# Altium schematic sheet STM32F103_coreboard_2.SchDoc
size A4; SheetNumber: 2
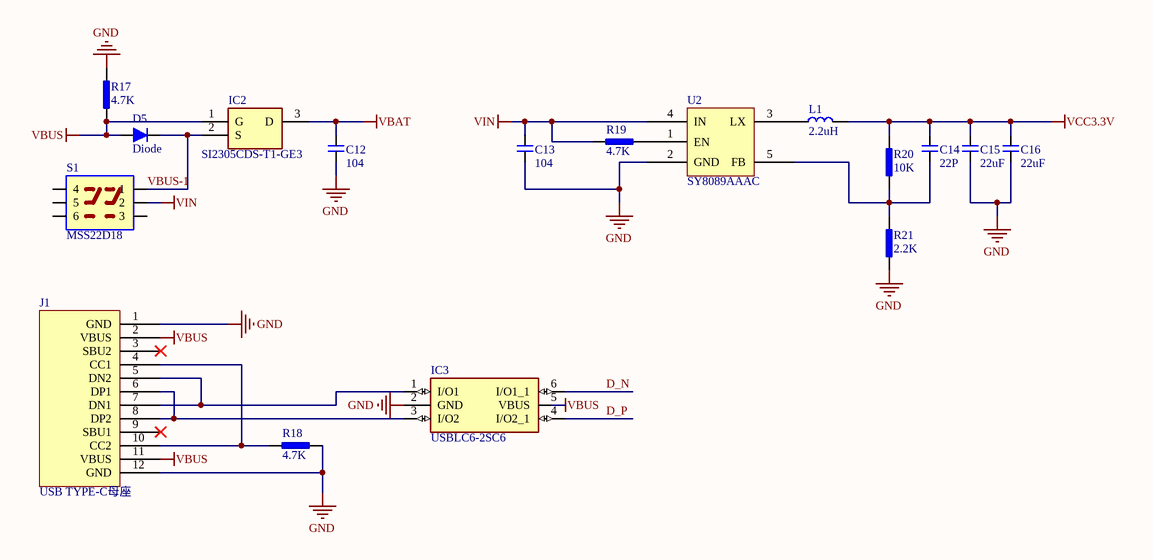
[diagram p0: STM32F103_coreboard_2.SchDoc]

## Parts
C12  104  [C0603]
C13  104  [C0603]
C14  22P  [C0603]
C15  22uF  [C0603]
C16  22uF  [C0603]
D5  Diode  [SOD123]
IC2  SI2305CDS-T1-GE3  [SOT95P237X112-3N]
IC3  USBLC6-2SC6  [SOT95P280X145-6N]
J1  USB TYPE-C母座  [USB-TYPEC-SMT]
L1  2.2uH  [L-CDR5*5]
R17  4.7K  [R0603]
R18  4.7K  [R0603]
R19  4.7K  [R0603]
R20  10K  [R0603]
R21  2.2K  [R0603]
S1  MSS22D18  [SWITCH-MSS22D18]
U2  SY8089AAAC  [SOT-23-5]

## Nets
GND: C12.1 C13.1 C15.1 C16.1 IC3.2(GND) J1.1(GND) J1.12(GND) R17.1 R18.2 R21.1 U2.2(GND)
VBAT: C12.2 IC2.3(D)
VBUS: D5.1 IC2.1(G) IC3.5(VBUS) J1.2(VBUS) J1.11(VBUS) R17.2
VCC3.3V: C14.2 C15.2 C16.2 L1.1 R20.2
VIN: C13.2 R19.1 S1.2 U2.4(IN)
D_N: IC3.6(I/O1_1)
D_P: IC3.4(I/O2_1)
VBUS-1: D5.2 IC2.2(S) S1.1
NetC14_1: C14.1 R20.1 R21.2 U2.5(FB)
NetIC3_1: IC3.1(I/O1) J1.5(DN2) J1.7(DN1)
NetIC3_3: IC3.3(I/O2) J1.6(DP1) J1.8(DP2)
NetJ1_4: J1.4(CC1) J1.10(CC2) R18.1
NetL1_2: L1.2 U2.3(LX)
NetR19_2: R19.2 U2.1(EN)

Not connected (* = marked no-connect by the designer): J1 3(SBU2)* 9(SBU1)*; S1 3 4 5 6

## Library data of the parts
C12-C16 = CAP
IC2 = SI2305CDS-T1-GE3: Integrated Circuit; Manufacturer_Name: Vishay; Allied_Number: R1082505; Datasheet Link: http://www.vishay.com/docs/64847/si2305cd.pdf; Height: 1.12mm; Manufacturer_Part_Number: SI2305CDS-T1-GE3; Mouser Part Number: 781-SI2305CDS-GE3; Mouser Price/Stock: https://www.mouser.com/Search/Refine.aspx?Keyword=781-SI2305CDS-GE3; RS Part Number: 7103248P; RS Price/Stock: http://uk.rs-online.com/web/p/products/7103248P; Allied Price/Stock: http://www.alliedelec.com/vishay-dale-si2305cds-t1-ge3/R1082505/
IC3 = USBLC6-2SC6: Integrated Circuit; Manufacturer_Name: STMicroelectronics; Allied_Number: 70389689; Datasheet Link: http://www.st.com/st-web-ui/static/active/en/resource/technical/document/datasheet/CD00050750.pdf; Height: 1.45mm; Manufacturer_Part_Number: USBLC6-2SC6; Mouser Part Number: 511-USBLC6-2SC6; Mouser Price/Stock: https://www.mouser.com/Search/Refine.aspx?Keyword=511-USBLC6-2SC6; RS Part Number: 6247693P; RS Price/Stock: http://uk.rs-online.com/web/p/products/6247693P; Allied Price/Stock: http://www.alliedelec.com/stmicroelectronics-usblc6-2sc6/70389689/
J1 = USB TYPE-C
L1 = Inductance
R17-R21 = RES
S1 = SWITCH-MSS22D18